# EAGLE schematic PIC32MX250F128B (EAGLE 5.12)
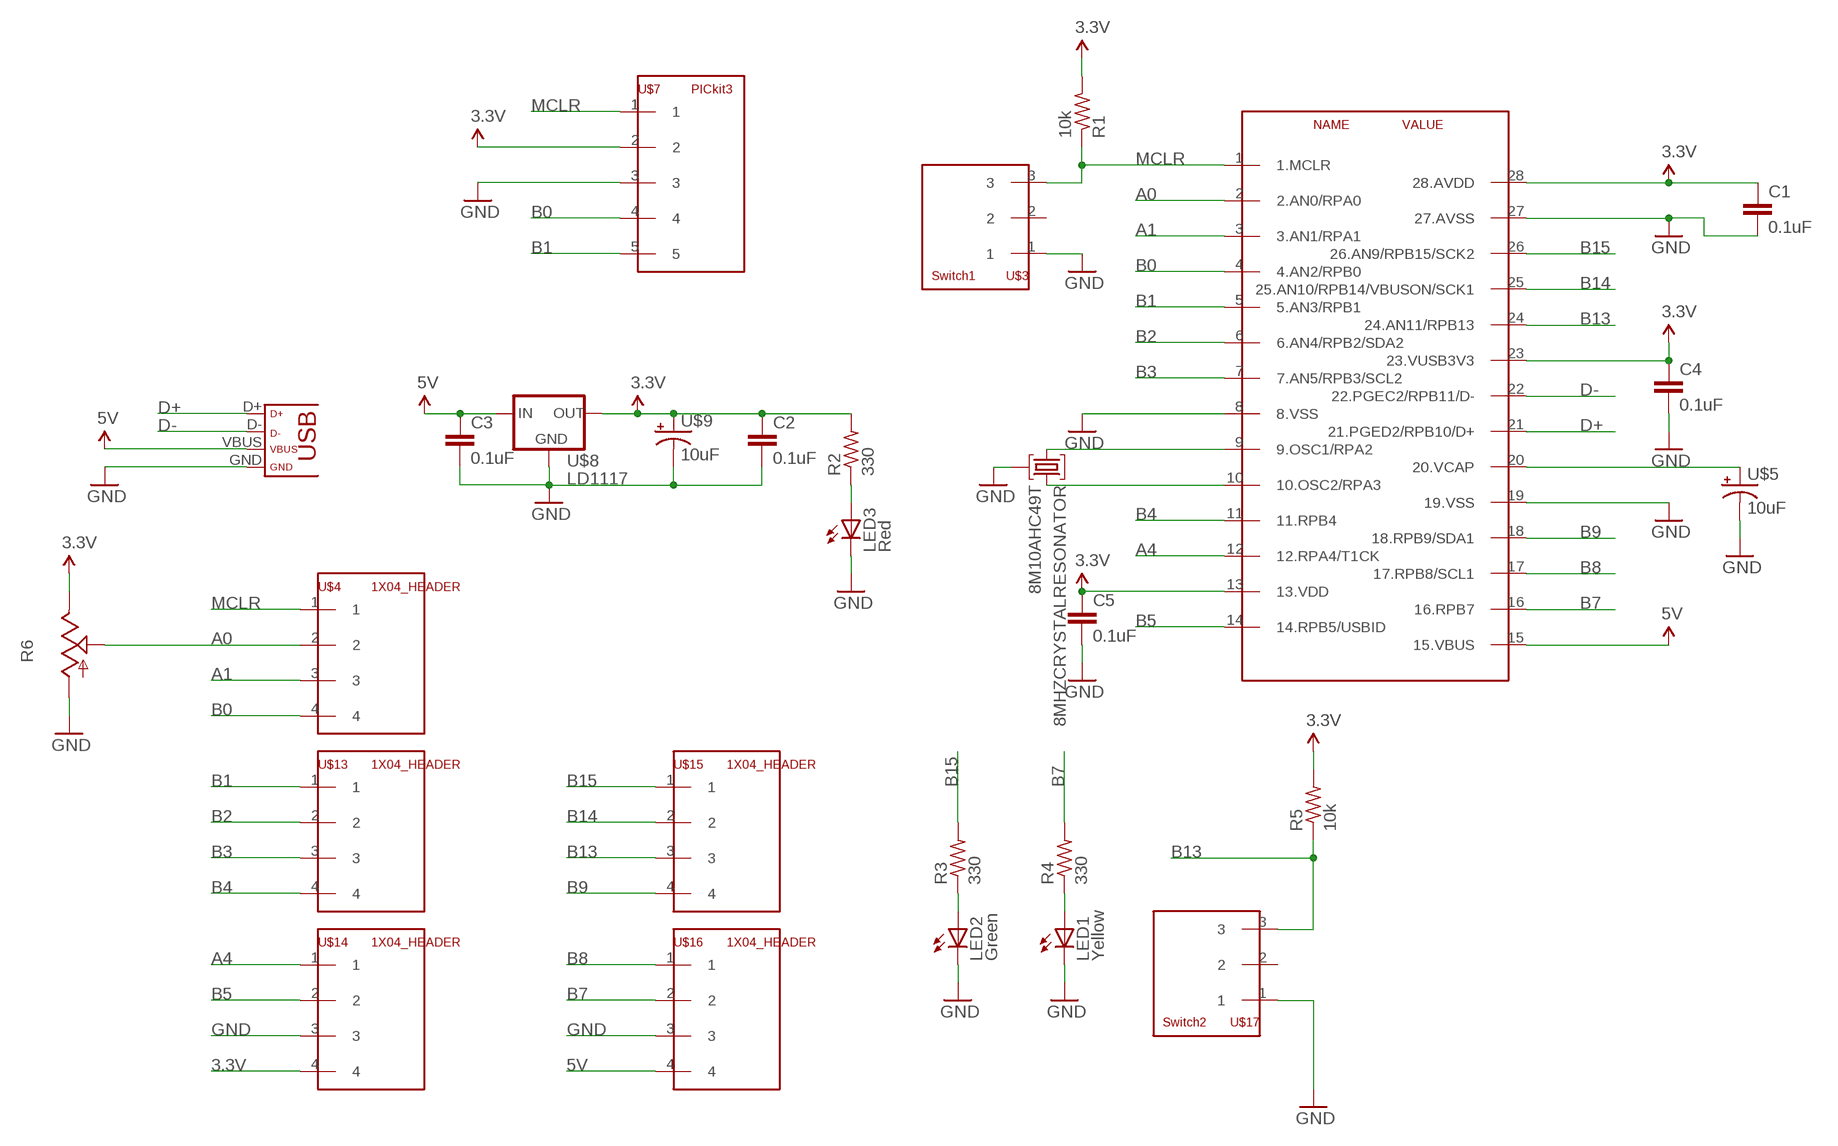
[diagram p0: schematic, sheet 1]

## Parts
8MHZCRYSTALRESONATOR  8M10AHC49T  [HC49U]
C1  0.1uF  C2.5/2  [C2.5-2]
C2  0.1uF  C2.5/2  [C2.5-2]
C3  0.1uF  C2.5/2  [C2.5-2]
C4  0.1uF  C2.5/2  [C2.5-2]
C5  0.1uF  C2.5/2  [C2.5-2]
LED1  Yellow  LED3MM  [LED3MM]
LED2  Green  LED3MM  [LED3MM]
LED3  Red  LED3MM  [LED3MM]
R1  10k  R-US_0207/7  [0207/7]
R2  330  R-US_0204/7  [0204/7]
R3  330  R-US_0204/7  [0204/7]
R4  330  R-US_0204/7  [0204/7]
R5  10k  R-US_0204/7  [0204/7]
R6  TRIM_US-3223W  [3223W]
U$1  PIC32MX250F128B  [DIL28-3]
U$3  Switch1  1X03_HEADER  [1X03]
U$4  1X04_HEADER  [1X04]
U$5  10uF  CAP_POL  [CAP_POL_D]
U$7  PICkit3  1X05_HEADER  [1X05]
U$8  LD1117  [TO220]
U$9  10uF  CAP_POL  [CAP_POL_D]
U$11  USB  [USB-MINIB]
U$13  1X04_HEADER  [1X04]
U$14  1X04_HEADER  [1X04]
U$15  1X04_HEADER  [1X04]
U$16  1X04_HEADER  [1X04]
U$17  Switch2  1X03_HEADER  [1X03]

## Nets
3.3V: C2.1 C4.1 C5.1 R1.2 R2.2 R5.2 R6.3(E) U$1.13(13.VDD) U$1.23(23.VUSB3V3) U$8.2(OUT) U$9.1(+) U$14.4
5V: C3.1 U$1.15(15.VBUS) U$8.3(IN) U$16.4
A0: R6.2(S) U$1.2(2.AN0/RPA0) U$4.2
A1: U$1.3(3.AN1/RPA1) U$4.3
A4: U$1.12(12.RPA4/T1CK) U$14.1
B0: U$1.4(4.AN2/RPB0) U$4.4 U$7.4
B1: U$1.5(5.AN3/RPB1) U$7.5 U$13.1
B2: U$1.6(6.AN4/RPB2/SDA2) U$13.2
B3: U$1.7(7.AN5/RPB3/SCL2) U$13.3
B4: U$1.11(11.RPB4) U$13.4
B5: U$1.14(14.RPB5/USBID) U$14.2
B7: R4.2 U$1.16(16.RPB7) U$16.2
B8: U$1.17(17.RPB8/SCL1) U$16.1
B9: U$1.18(18.RPB9/SDA1) U$15.4
B13: R5.1 U$1.24(24.AN11/RPB13) U$15.3 U$17.3
B14: U$1.25(25.AN10/RPB14/VBUSON/SCK1) U$15.2
B15: R3.2 U$1.26(26.AN9/RPB15/SCK2) U$15.1
D+: U$1.21(21.PGED2/RPB10/D+) U$11.D+
D-: U$1.22(22.PGEC2/RPB11/D-) U$11.D-
GND: 8MHZCRYSTALRESONATOR.2 C2.2 C3.2 C4.2 C5.2 LED1.K(C) LED2.K(C) LED3.K(C) R6.1(A) U$1.8(8.VSS) U$1.19(19.VSS) U$5.2(-) U$8.1(GND) U$9.2(-) U$14.3 U$16.3 U$17.1
MCLR: R1.1 U$1.1(1.MCLR) U$3.3 U$4.1 U$7.1
N$1: LED3.A R2.1
N$2: U$3.1 ; supply symbol labelled GND
N$3: 8MHZCRYSTALRESONATOR.1 U$1.9(9.OSC1/RPA2)
N$4: LED2.A R3.1
N$5: LED1.A R4.1
N$6: U$11.VBUS ; supply symbol labelled 5V
N$7: U$11.GND ; supply symbol labelled GND
N$10: 8MHZCRYSTALRESONATOR.3 U$1.10(10.OSC2/RPA3)
N$14: C1.1 U$1.28(28.AVDD) ; supply symbol labelled 3.3V
N$16: C1.2 ; supply symbol labelled GND
N$23: U$1.20(20.VCAP) U$5.1(+)
N$28: U$7.2 ; supply symbol labelled 3.3V
N$29: U$7.3 ; supply symbol labelled GND
Unconnected: U$1.27(27.AVSS) U$3.2 U$17.2

## Library data of the parts
8MHZCRYSTALRESONATOR = ME433:8M10AHC49T: Monolithic Crystal Filters Source: www.vanlong.com; OC_FARNELL: unknown; OC_NEWARK: unknown
C1-C5 = ME433:C: CAPACITOR naming: grid - package width
LED1-LED3 = ME433:LED: LED OSRAM: - CHIPLED LG R971, LG N971, LY N971, LG Q971, LY Q971, LO R971, LY R971 LH N974, LH R974 LS Q976, LO Q976, LY Q976 LO Q996 - Hyper CHIPLED LW Q18S LB Q993, LB Q99A, LB R99A - SideLED LS A670, LO A670, LY A670, LG A670, LP A670 LB A673, LV A673, LT A673, LW A673 LH A674 LY A675 LS A676, LA A676, LO A676, LY A676, LW A676 LS A679, LY A679, LG A679 - Hyper Micro SIDELED® LS Y876, LA Y876, LO Y876, LY Y876 LT Y87S - SmartLED LW L88C, LW L88S LB L89C, LB L89S, LG L890 LS L89K, LO L89K, LY L89K LS L896, LA L896, LO L896, LY L896 - TOPLED LS T670, LO T670, LY T670, LG T670, LP T670 LSG T670, LSP T670, LSY T670, LOP T670, LYG T670 LG T671, LOG T671, LSG T671 LB T673, LV T673, LT T673, LW T673 LH T674 LS T676, LA T676, LO T676, LY T676, LB T676, LH T676, LSB T676, LW T676 LB T67C, LV T67C, LT T67C, LS T67K, LO T67K, LY T67K, LW E67C LS E67B, LA E67B, LO E67B, LY E67B, LB E67C, LV E67C, LT E67C LW T67C LS T679, LY T679, LG T679 LS T770, LO T770, LY T770, LG T770, LP T770 LB T773, LV T773, LT T773, LW T773 LH T774 LS E675, LA E675, LY E675, LS T675 LS T776, LA T776, LO T776, LY T776, LB T776 LHGB T686 LT T68C, LB T68C - Hyper Mini TOPLED® LB M676 - Mini TOPLED Santana® LG M470 LS M47K, LO M47K, LY M47K Source: http://www.osram.convergy.de LUXEON: - LUMILED® LXK2-PW12-R00, LXK2-PW12-S00, LXK2-PW14-U00, LXK2-PW14-V00 LXK2-PM12-R00, LXK2-PM12-S00, LXK2-PM14-U00 LXK2-PE12-Q00, LXK2-PE12-R00, LXK2-PE12-S00, LXK2-PE14-T00, LXK2-PE14-U00 LXK2-PB12-K00, LXK2-PB12-L00, LXK2-PB12-M00, LXK2-PB14-N00, LXK2-PB14-P00, LXK2-PB14-Q00 LXK2-PR12-L00, LXK2-PR12-M00, LXK2-PR14-Q00, LXK2-PR14-R00 LXK2-PD12-Q00, LXK2-PD12-R00, LXK2-PD12-S00 LXK2-PH12-R00, LXK2-PH12-S00 LXK2-PL12-P00, LXK2-PL12-Q00, LXK2-PL12-R00 Source: www.luxeon.com KINGBRIGHT: KA-3528ASYC Source: www.kingbright.com
R1-R5 = ME433:R-US_: RESISTOR, American symbol
R6 = ME433:TRIM_US-: POTENTIOMETER
U$1 = ME433:PIC32MX250F128B
U$3 U$17 = ME433:1X03_HEADER
U$4 U$13-U$16 = ME433:1X04_HEADER
U$5 U$9 = ME433:CAP_POL
U$7 = ME433:1X05_HEADER
U$8 = ME433:LD1117
U$11 = ME433:USB